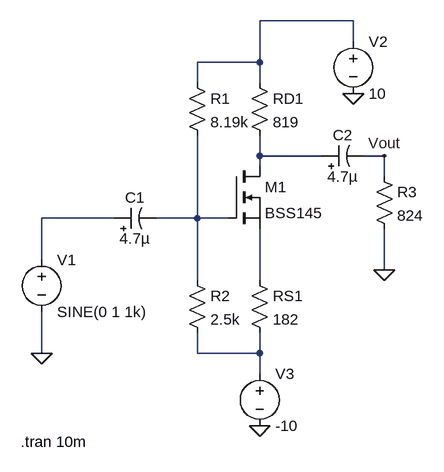
[diagram p0: schematic lab5.3d.asc]
lab5.3d.asc, the LTspice schematic file:
Version 4
SHEET 1 880 680
WIRE 368 -224 224 -224
WIRE 368 -192 368 -224
WIRE 224 -160 224 -224
WIRE 224 -160 128 -160
WIRE 128 -128 128 -160
WIRE 224 -128 224 -160
WIRE 224 -16 224 -48
WIRE 320 -16 224 -16
WIRE 416 -16 384 -16
WIRE 224 0 224 -16
WIRE 416 16 416 -16
WIRE 0 80 -112 80
WIRE 128 80 128 -48
WIRE 128 80 64 80
WIRE 176 80 128 80
WIRE -112 144 -112 80
WIRE 416 160 416 96
WIRE 128 176 128 80
WIRE 224 176 224 96
WIRE -112 288 -112 224
WIRE 128 288 128 256
WIRE 224 288 224 256
WIRE 224 288 128 288
WIRE 224 320 224 288
FLAG -112 288 0
FLAG 368 -112 0
FLAG 224 400 0
FLAG 416 -16 Vout
FLAG 416 160 0
SYMBOL voltage -112 128 R0
WINDOW 123 0 0 Left 0
WINDOW 39 0 0 Left 0
SYMATTR InstName V1
SYMATTR Value SINE(0 1 1k)
SYMBOL polcap 0 96 R270
WINDOW 0 32 32 VTop 2
WINDOW 3 0 32 VBottom 2
SYMATTR InstName C1
SYMATTR Value 4.7µ
SYMATTR Description Capacitor
SYMATTR Type cap
SYMATTR SpiceLine V=25 Irms=24m Rser=5 Lser=0 mfg="Nichicon" pn="UPR1E4R7MAH" type="Al electrolytic"
SYMBOL res 112 -144 R0
SYMATTR InstName R1
SYMATTR Value 8.19k
SYMBOL res 112 160 R0
SYMATTR InstName R2
SYMATTR Value 2.5k
SYMBOL nmos 176 0 R0
SYMATTR InstName M1
SYMATTR Value BSS145
SYMBOL res 208 -144 R0
SYMATTR InstName RD1
SYMATTR Value 819
SYMBOL res 208 160 R0
SYMATTR InstName RS1
SYMATTR Value 182
SYMBOL polcap 320 0 R270
WINDOW 0 32 32 VTop 2
WINDOW 3 0 32 VBottom 2
SYMATTR InstName C2
SYMATTR Value 4.7µ
SYMATTR Description Capacitor
SYMATTR Type cap
SYMATTR SpiceLine V=25 Irms=24m Rser=5 Lser=0 mfg="Nichicon" pn="UPR1E4R7MAH" type="Al electrolytic"
SYMBOL voltage 368 -208 R0
WINDOW 123 0 0 Left 0
WINDOW 39 0 0 Left 0
SYMATTR InstName V2
SYMATTR Value 10
SYMBOL voltage 224 304 R0
WINDOW 123 0 0 Left 0
WINDOW 39 0 0 Left 0
SYMATTR InstName V3
SYMATTR Value -10
SYMBOL res 400 0 R0
SYMATTR InstName R3
SYMATTR Value 824
TEXT -144 424 Left 2 !.tran 10m

The netlist it stands for:
* lab5.3d.asc
V1 N003 0 SINE(0 1 1k)
C1 N003 N004 4.7µ V=25 Irms=24m Rser=5 Lser=0 mfg="Nichicon" pn="UPR1E4R7MAH" type="Al electrolytic"
R1 N001 N004 8.19k
R2 N004 N006 2.5k
M1 N002 N004 N005 N005 BSS145
RD1 N001 N002 819
RS1 N005 N006 182
C2 N002 Vout 4.7µ V=25 Irms=24m Rser=5 Lser=0 mfg="Nichicon" pn="UPR1E4R7MAH" type="Al electrolytic"
V2 N001 0 10
V3 N006 0 -10
R3 Vout 0 824
.model NMOS NMOS
.model PMOS PMOS
.lib standard.mos
.tran 10m
.backanno
.end